# Altium schematic sheet BLDC_v3.SCHDOC
size 594 x 420 mm; CompanyName: МГТУ СМ-7; SheetNumber: 1; SheetTotal: 2; Scale: 1:1; Title2str: Драйвер BLDC; DocumentType: Схема электрическая принципиальная
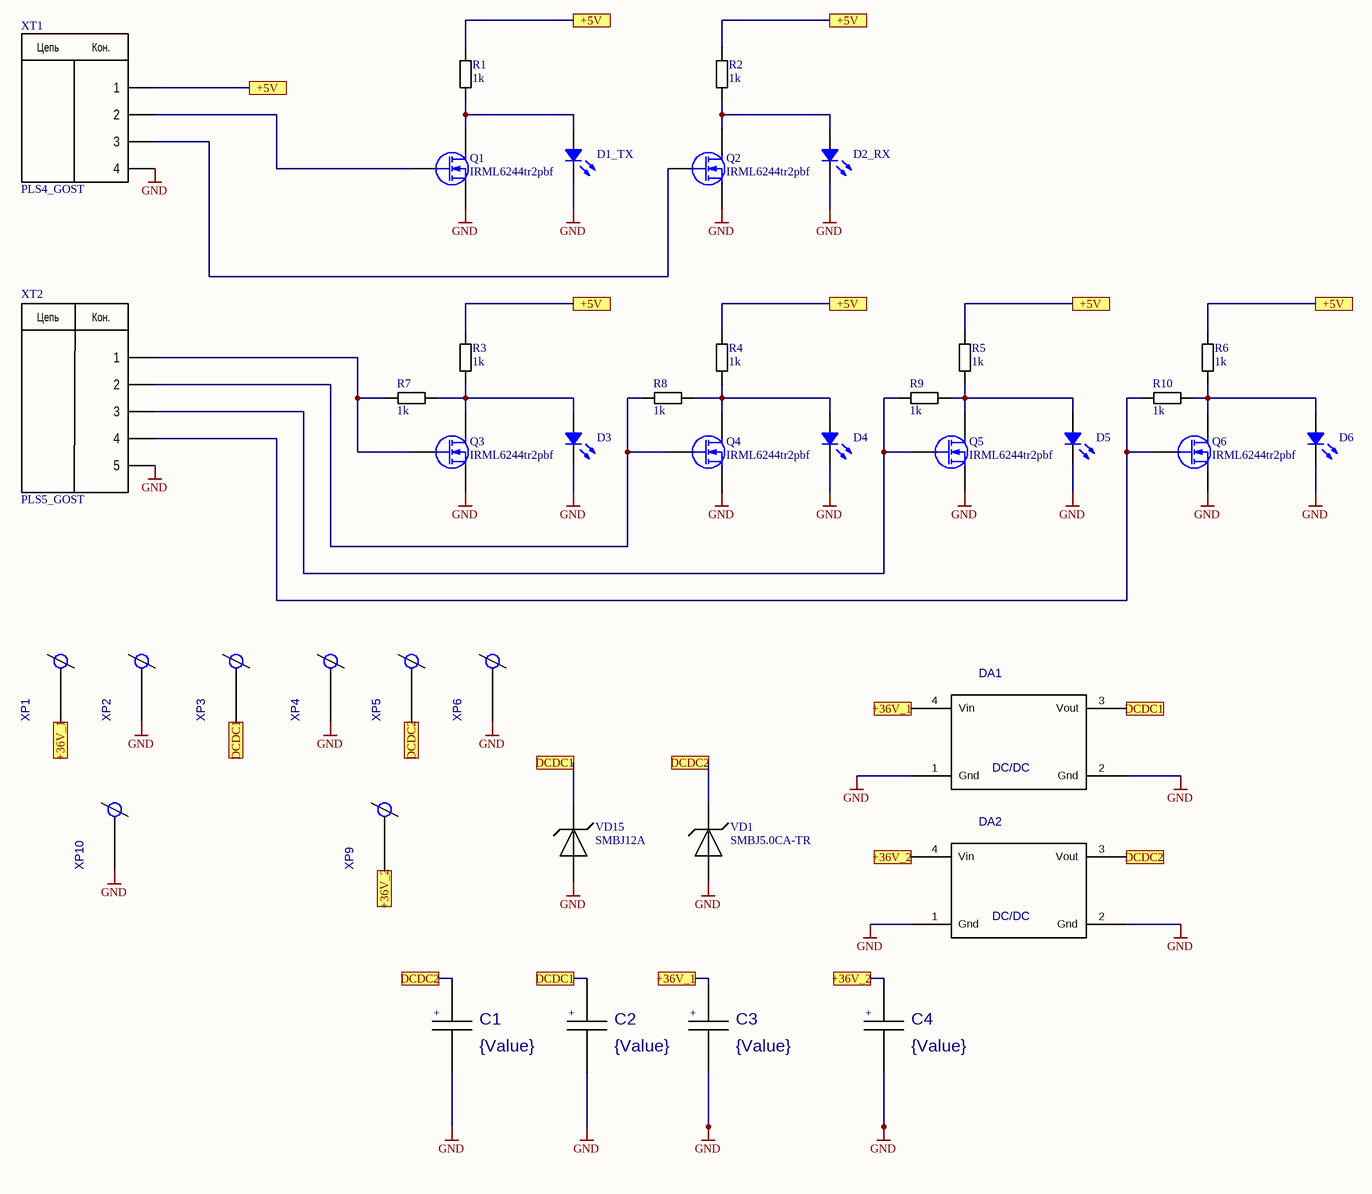
[diagram p0: BLDC_v3.SCHDOC]

## Parts
C1  value {Value}  [C100_WIDE]  (hidden comment: C100_V_WIDE)
C2  value {Value}  [C100_WIDE]  (hidden comment: C100_V_WIDE)
C3  value {Value}  [C100_WIDE]  (hidden comment: C100_V_WIDE)
C4  value {Value}  [C100_WIDE]  (hidden comment: C100_V_WIDE)
D1_TX  Green  [LED 0805/2012 BLUE]  (value not drawn)
D2_RX  Green  [LED 0805/2012 BLUE]  (value not drawn)
D3  Green  [LED 0805/2012 BLUE]  (value not drawn)
D4  Green  [LED 0805/2012 BLUE]  (value not drawn)
D5  Green  [LED 0805/2012 BLUE]  (value not drawn)
D6  Green  [LED 0805/2012 BLUE]  (value not drawn)
DA1  DC/DC  [XL4016]
DA2  DC/DC  [XL4016]
Q1  IRML6244tr2pbf  [SOT23_N]
Q2  IRML6244tr2pbf  [SOT23_N]
Q3  IRML6244tr2pbf  [SOT23_N]
Q4  IRML6244tr2pbf  [SOT23_N]
Q5  IRML6244tr2pbf  [SOT23_N]
Q6  IRML6244tr2pbf  [SOT23_N]
R1  1k  [SMT0603/VISHAY]
R2  1k  [SMT0603/VISHAY]
R3  1k  [SMT0603/VISHAY]
R4  1k  [SMT0603/VISHAY]
R5  1k  [SMT0603/VISHAY]
R6  1k  [SMT0603/VISHAY]
R7  1k  [SMT0603/VISHAY]
R8  1k  [SMT0603/VISHAY]
R9  1k  [SMT0603/VISHAY]
R10  1k  [SMT0603/VISHAY]
VD1  SMBJ5.0CA-TR  [DO214AA SMB]
VD15  SMBJ12A  [DO214AA SMB]
XP1  XP_1_WIDE  [XP_WIDE]  (value not drawn)
XP2  XP_1_WIDE  [XP_WIDE]  (value not drawn)
XP3  XP_1_WIDE  [XP_WIDE]  (value not drawn)
XP4  XP_1_WIDE  [XP_WIDE]  (value not drawn)
XP5  XP_1_WIDE  [XP_WIDE]  (value not drawn)
XP6  XP_1_WIDE  [XP_WIDE]  (value not drawn)
XP9  XP_1_WIDE  [XP_WIDE]  (value not drawn)
XP10  XP_1_WIDE  [XP_WIDE]  (value not drawn)
XT1  PLS4_GOST  [XP_4_PIN_2]
XT2  PLS5_GOST  [XP_5_PIN]

## Ports
+5V, +36V_1, +36V_2, DCDC1, DCDC2

## Nets
GND: C1.2(A1) C2.2(A1) C3.2(A1) C4.2(A1) D1_TX.2 D2_RX.2 D3.2 D4.2 D5.2 D6.2 DA1.1(Gnd) DA1.2(Gnd) DA2.1(Gnd) DA2.2(Gnd) Q1.3(S) Q2.3(S) Q3.3(S) Q4.3(S) Q5.3(S) Q6.3(S) VD1.1 VD15.1 XP2.1 XP4.1 XP6.1 XP10.1 XT1.4 XT2.5
+5V: R1.2 R2.2 R3.2 R4.2 R5.2 R6.2 XT1.1 ; port +5V
+36V_1: C3.1(A2) DA1.4(Vin) XP1.1 ; port +36V_1
+36V_2: C4.1(A2) DA2.4(Vin) XP9.1 ; port +36V_2
DCDC1: C2.1(A2) DA1.3(Vout) VD15.2 XP3.1 ; port DCDC1
DCDC2: C1.1(A2) DA2.3(Vout) VD1.2 XP5.1 ; port DCDC2
NetD1_TX_1: D1_TX.1 Q1.1(D) R1.1
NetD2_RX_1: D2_RX.1 Q2.1(D) R2.1
NetD3_1: D3.1 Q3.1(D) R3.1 R7.1
NetD4_1: D4.1 Q4.1(D) R4.1 R8.1
NetD5_1: D5.1 Q5.1(D) R5.1 R9.1
NetD6_1: D6.1 Q6.1(D) R6.1 R10.1
NetQ1_2: Q1.2(G) XT1.2
NetQ2_2: Q2.2(G) XT1.3
NetQ3_2: Q3.2(G) R7.2 XT2.1
NetQ4_2: Q4.2(G) R8.2 XT2.2
NetQ5_2: Q5.2(G) R9.2 XT2.3
NetQ6_2: Q6.2(G) R10.2 XT2.4

## Notes on the sheet
- Перв. примен.
- Справ. №
- Подп. и дата
- Инв. № дубл.
- Взам. инв. №
- Разраб.
- Изм.
- Лист
- № докум.
- Подп.
- Дата
- Лит.
- Масса
- Масштаб
- Пров.
- Т.контр.
- Листов
- Инв. № подл.
- Утв.
- Н.контр.
- 2.106-A2
- Копировал
- Формат А2
- (in symbol C100_V_WIDE) +
- (in symbol PLS4_GOST) Цепь; Кон.
- (in symbol PLS5_GOST_1) Цепь; Кон.

## Library data of the parts
D1_TX D2_RX D3-D6 = LED: Chip LED; Value: Green
DA1 DA2 = XL4016_DCDC: Value: *
Q1-Q6 = IRML6244tr2pbf: N-Channel MOSFET; pin to pad: 1>3 2>1 3>2; Published: 8-Jun-2000; LatestRevisionDate: 17-Jul-2002; LatestRevisionNote: Re-released for DXP Platform.; PackageVersion: 1995/1996; PackageReference: E3; Publisher: Altium Limited; PackageDescription: TO, Flat Index; 3 In-Line, Axial Leads; Body Dia. 4.6mm; Lead Dia. 0.5 mm (max)
R1-R10 = CRCW060310K0FKEA/MURATA: 10k
XT1 = PLS4_GOST: Header, 5-Pin; LatestRevisionDate: 17-Jul-2002; LatestRevisionNote: Re-released for DXP Platform.; Publisher: Altium Limited
XT2 = PLS5_GOST_1: Header, 5-Pin; LatestRevisionDate: 17-Jul-2002; LatestRevisionNote: Re-released for DXP Platform.; Publisher: Altium Limited
XP1-XP6 XP9 XP10 = XP_1_WIDE: Value: *